# EAGLE design uDiplexer_v2 (EAGLE 9.1.0)
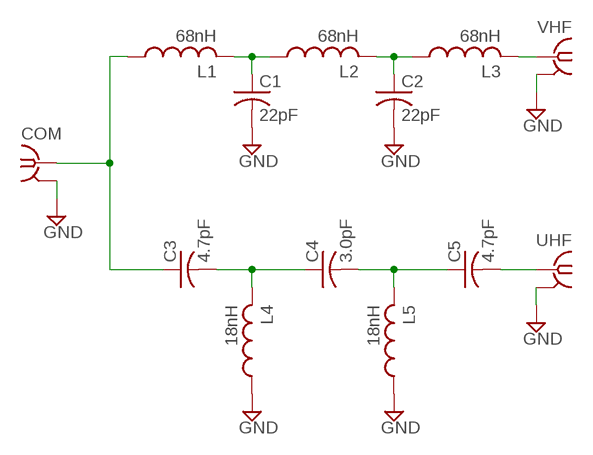
[diagram p0: schematic, sheet 1]

## Parts
C1  22pF  C-USC0805K  [C0805K]
C2  22pF  C-USC0805K  [C0805K]
C3  4.7pF  C-USC0805K  [C0805K]
C4  3.0pF  C-USC0805K  [C0805K]
C5  4.7pF  C-USC0805K  [C0805K]
COM  BU-SMA-V  [BU-SMA-V]
L1  68nH  L-US0805K  [C0805K]
L2  68nH  L-US0805K  [C0805K]
L3  68nH  L-US0805K  [C0805K]
L4  18nH  L-US0805K  [C0805K]
L5  18nH  L-US0805K  [C0805K]
UHF  BU-SMA-V  [BU-SMA-V]
VHF  BU-SMA-V  [BU-SMA-V]

## Nets
GND: C1.2 C2.2 COM.2 COM.3 COM.4 COM.5 L4.1 L5.1 UHF.2 UHF.3 UHF.4 UHF.5 VHF.2 VHF.3 VHF.4 VHF.5
N$1: C1.1 L1.2 L2.1
N$2: C2.1 L2.2 L3.1
N$3: L3.2 VHF.1
N$4: C3.2 C4.1 L4.2
N$5: C4.2 C5.1 L5.2
N$6: C5.2 UHF.1
N$7: C3.1 COM.1 L1.1

## Library data of the parts
C1-C5 = rcl:C-US: CAPACITOR, American symbol; SPICEPREFIX: C
COM UHF VHF = con-coax:BU-SMA-V: FEMALE SMA CONNECTOR Radiall distributor RS 112-3794; OC_FARNELL: unknown; OC_NEWARK: unknown
L1-L5 = kj4qlp:L-US0805K

## Board
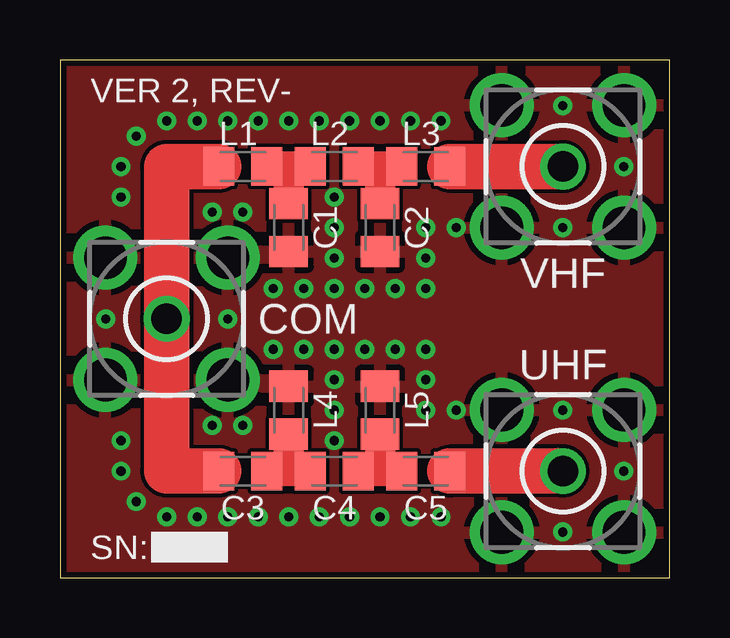
[diagram p1: board, top side]
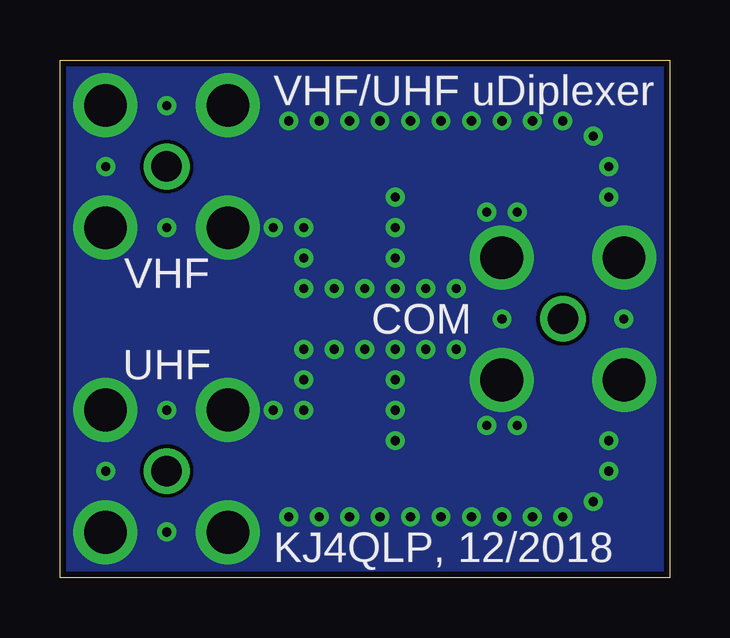
[diagram p2: board, bottom side, seen from below]

Size 25.4 x 21.59 mm. Coordinates in mm from the lower left corner, seen from the top.
Outline: 0,0 25.4,0 25.4,21.59 0,21.59 0,0
Copper layers (1*16): Top 0.035mm / dielectric 1.5mm / Bottom 0.035mm
Design rules "default *": minimum track width 6mil, minimum drill 0.35mm, track to track 6mil, track to pad 6mil, pad to pad 6mil, via to via 6mil, smd to smd 6mil, copper to edge 10mil, drill to drill 6mil, minimum pad ring 10mil, minimum via ring 8mil, stop-mask expansion 4mil, vias tented up to drill 15mil, thermal gap 10mil

### Footprints (pad centres in the part's own frame; a part is rotated, then mirrored left to right if it is on the bottom)
C0805K = smd 1.3 x 1.6: 1 -1,0; 2 1,0
BU-SMA-V = drill 1.27: 1 0,0 | drill 1.778: 2 -2.55,2.55; 3 2.55,2.55; 4 2.55,-2.55; 5 -2.55,-2.55

### Placement (x,y rotation side)
C1  9.53,14.61 270 top
C2  13.34,14.61 270 top
C3  7.62,4.45 0 top
C4  11.43,4.45 0 top
C5  15.24,4.45 0 top
COM  4.45,10.79 0 top
L1  7.62,17.14 0 top
L2  11.43,17.14 0 top
L3  15.24,17.14 0 top
L4  9.53,6.99 270 top
L5  13.34,6.99 270 top
UHF  20.95,4.45 0 top
VHF  20.95,17.14 0 top

### Tracks (layer width: path | path; a pad name or v marks a point on that pad's centre or on a via)
GND  (via drill 0.38)
  other vias: 10.16,12.06 12.7,9.53 13.97,12.06 15.24,13.34 15.24,14.61 10.16,9.53 13.97,9.53 11.43,9.53 11.43,5.71 10.79,2.54 12.06,2.54 9.53,2.54 8.26,2.54 6.99,2.54 5.71,2.54 4.45,2.54 3.17,3.17 2.54,4.45 2.54,5.71 12.06,19.05 10.79,19.05 9.53,19.05 8.26,19.05 6.99,19.05 5.71,19.05 4.45,19.05 3.17,18.41 2.54,17.14 2.54,15.88 13.34,19.05 14.61,19.05 15.88,19.05 6.35,15.24 7.62,15.24 6.99,10.79 1.91,10.79 13.34,2.54 14.61,2.54 15.88,2.54 11.43,6.99 11.43,8.26 8.89,9.53 15.24,9.53 15.24,8.26 15.24,6.99 16.51,6.99 6.35,6.35 7.62,6.35 8.89,12.06 11.43,12.06 12.7,12.06 11.43,13.34 11.43,14.61 11.43,15.88 15.24,12.06 16.51,14.61 20.95,6.99 23.5,4.45 20.95,1.91 20.95,14.61 23.5,17.14 20.95,19.68
  pour Bottom (no thermals): 0,21.59 0,0 25.4,0 25.4,21.59
  pour Top: 0,21.59 25.4,21.59 25.4,0 0,0
N$1
  Top 1.27: 9.53,17.14 10.16,17.14 L2.1 | C1.1 9.53,17.14 | L1.2 9.53,17.14
N$2
  Top 1.27: 13.34,17.14 13.97,17.14 L3.1 | C2.1 13.34,17.14 | L2.2 13.34,17.14
N$3
  Top 1.905: L3.2 VHF.1
N$4
  Top 1.27: 9.53,4.45 10.16,4.45 C4.1 | L4.2 9.53,4.45 | C3.2 9.53,4.45
N$5
  Top 1.27: 13.34,4.45 13.97,4.45 C5.1 | L5.2 13.34,4.45 | C4.2 13.34,4.45
N$6
  Top 1.905: UHF.1 C5.2
N$7
  Top 1.905: L1.1 4.45,17.14 COM.1 4.45,4.45 C3.1

### Text on the board
tPlace: VER 2, REV- | SN:
bPlace: VHF/UHF uDiplexer | VHF | COM | UHF | KJ4QLP, 12/2018